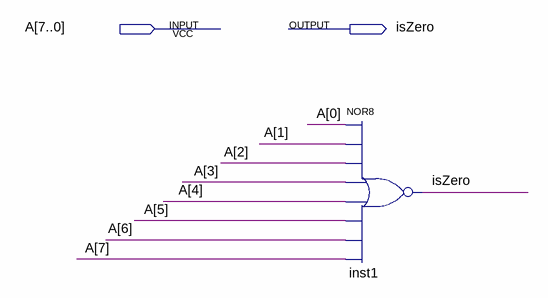
[diagram p0: schematic sheet]
// Quartus schematic zero.bdf as structural Verilog: 1 symbols, 2 pins
module zero (
  input  [7:0] A,
  output isZero
);

  nor inst1 (isZero, A[0], A[1], A[2], A[3], A[4], A[5], A[6], A[7]);
endmodule
